# Altium project MCU009B.PrjPcb (part 3 of 4)

## Sheet MCU009B_ADC.SchDoc: ADC
size 431 x 279 mm; Date: Not shown in title block; ApprovedBy: Not shown in title block; CheckedBy: Not shown in title block; Author: Not shown in title block; CompanyName: Not shown in title block; Engineer: Not shown in title block; Organization: Not shown in title block; Address1: Not shown in title block; Address2: Not shown in title block; Address3: Not shown in title block; Address4: Not shown in title block; DocumentNumber: 4; Revision: Use project parameter SCH_Rev; SheetNumber: 4; SheetTotal: 7; PageSetup: Record=PageOptions|CenterHorizontal=True|CenterVertical=True|PrintScale=1.00|XCorrection=1.00|YCorrection=1.00|PrintKind=0|BorderSize=5000000|LeftOffset=0|BottomOffset=0|Orientation=2|PaperLength=1000|PaperWidth=1000|Scale=100|PaperSource=15|PrintQuality=600|MediaType=1|DitherType=10|PaperKind=Letter|PrintScaleMode=1; CurrentTime: Not shown in title block; CurrentDate: Not shown in title block; Time: Not shown in title block; DocumentFullPathAndName: Not shown in title block; DocumentName: Not shown in title block; ModifiedDate: Not shown in title block; ImagePath: Not shown in title block
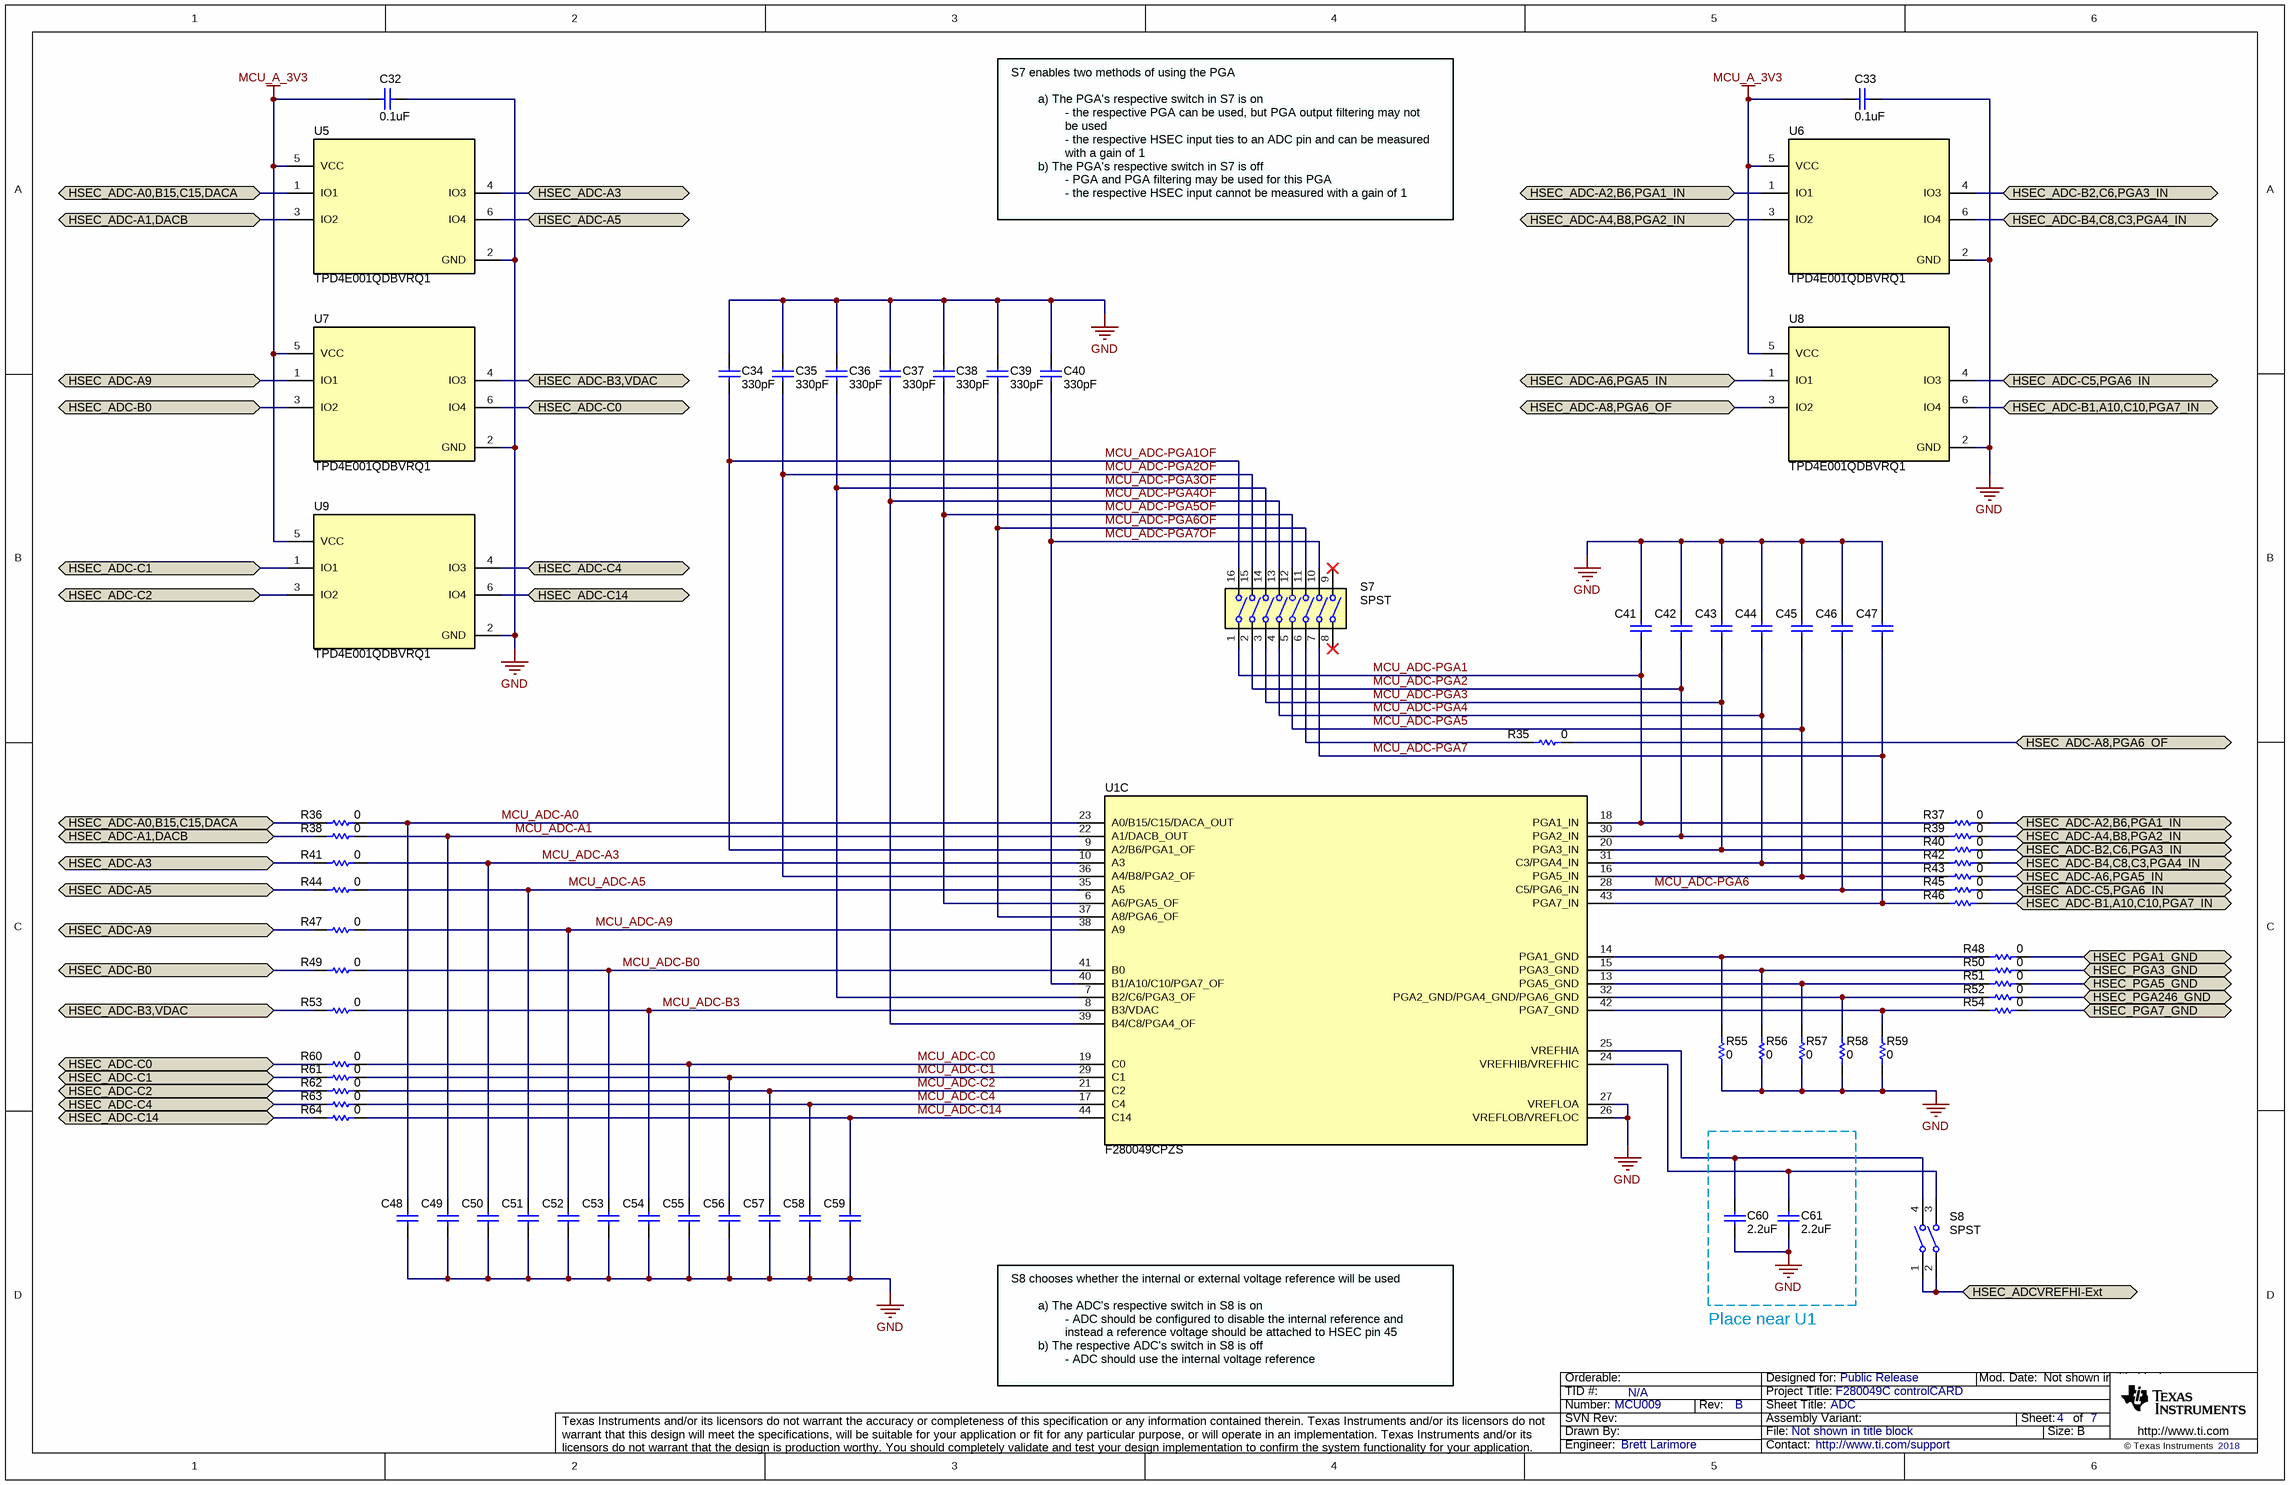
[diagram p3: MCU009B_ADC.SchDoc]

### Parts
(Parts that share a designator on the sheet are numbered #1, #2 ... from top to bottom, then left to right.)
C32  ValueDisplayed: 0.1uF  [0402]  (hidden comment: GRM155R71A104KA01D)
C33  ValueDisplayed: 0.1uF  [0402]  (hidden comment: GRM155R71A104KA01D)
C34  ValueDisplayed: 330pF  [0603]  (hidden comment: GRM1885C1H331JA01D)
C35  ValueDisplayed: 330pF  [0603]  (hidden comment: GRM1885C1H331JA01D)
C36  ValueDisplayed: 330pF  [0603]  (hidden comment: GRM1885C1H331JA01D)
C37  ValueDisplayed: 330pF  [0603]  (hidden comment: GRM1885C1H331JA01D)
C38  ValueDisplayed: 330pF  [0603]  (hidden comment: GRM1885C1H331JA01D)
C39  ValueDisplayed: 330pF  [0603]  (hidden comment: GRM1885C1H331JA01D)
C40  ValueDisplayed: 330pF  [0603]  (hidden comment: GRM1885C1H331JA01D)
C41  GRM188R71C104KA01D  [0603]  (value not drawn)
C42  GRM188R71C104KA01D  [0603]  (value not drawn)
C43  GRM188R71C104KA01D  [0603]  (value not drawn)
C44  GRM188R71C104KA01D  [0603]  (value not drawn)
C45  GRM188R71C104KA01D  [0603]  (value not drawn)
C46  GRM188R71C104KA01D  [0603]  (value not drawn)
C47  GRM188R71C104KA01D  [0603]  (value not drawn)
C48  GRM188R71C104KA01D  [0603]  (value not drawn)
C49  GRM188R71C104KA01D  [0603]  (value not drawn)
C50  GRM188R71C104KA01D  [0603]  (value not drawn)
C51  GRM188R71C104KA01D  [0603]  (value not drawn)
C52  GRM188R71C104KA01D  [0603]  (value not drawn)
C53  GRM188R71C104KA01D  [0603]  (value not drawn)
C54  GRM188R71C104KA01D  [0603]  (value not drawn)
C55  GRM188R71C104KA01D  [0603]  (value not drawn)
C56  GRM188R71C104KA01D  [0603]  (value not drawn)
C57  GRM188R71C104KA01D  [0603]  (value not drawn)
C58  GRM188R71C104KA01D  [0603]  (value not drawn)
C59  GRM188R71C104KA01D  [0603]  (value not drawn)
C60  ValueDisplayed: 2.2uF  [0603]  (hidden comment: GRM188R61A225KE34D)
C61  ValueDisplayed: 2.2uF  [0603]  (hidden comment: GRM188R61A225KE34D)
R35  ValueDisplayed: 0  [0603]  (hidden comment: CRCW06030000Z0EA)
R36  ValueDisplayed: 0  [0603]  (hidden comment: CRCW06030000Z0EA)
R37  ValueDisplayed: 0  [0603]  (hidden comment: CRCW06030000Z0EA)
R38  ValueDisplayed: 0  [0603]  (hidden comment: CRCW06030000Z0EA)
R39  ValueDisplayed: 0  [0603]  (hidden comment: CRCW06030000Z0EA)
R40  ValueDisplayed: 0  [0603]  (hidden comment: CRCW06030000Z0EA)
R41  ValueDisplayed: 0  [0603]  (hidden comment: CRCW06030000Z0EA)
R42  ValueDisplayed: 0  [0603]  (hidden comment: CRCW06030000Z0EA)
R43  ValueDisplayed: 0  [0603]  (hidden comment: CRCW06030000Z0EA)
R44  ValueDisplayed: 0  [0603]  (hidden comment: CRCW06030000Z0EA)
R45  ValueDisplayed: 0  [0603]  (hidden comment: CRCW06030000Z0EA)
R46  ValueDisplayed: 0  [0603]  (hidden comment: CRCW06030000Z0EA)
R47  ValueDisplayed: 0  [0603]  (hidden comment: CRCW06030000Z0EA)
R48  ValueDisplayed: 0  [0603]  (hidden comment: CRCW06030000Z0EA)
R49  ValueDisplayed: 0  [0603]  (hidden comment: CRCW06030000Z0EA)
R50  ValueDisplayed: 0  [0603]  (hidden comment: CRCW06030000Z0EA)
R51  ValueDisplayed: 0  [0603]  (hidden comment: CRCW06030000Z0EA)
R52  ValueDisplayed: 0  [0603]  (hidden comment: CRCW06030000Z0EA)
R53  ValueDisplayed: 0  [0603]  (hidden comment: CRCW06030000Z0EA)
R54  ValueDisplayed: 0  [0603]  (hidden comment: CRCW06030000Z0EA)
R55  ValueDisplayed: 0  [0603]  (hidden comment: CRCW06030000Z0EA)
R56  ValueDisplayed: 0  [0603]  (hidden comment: CRCW06030000Z0EA)
R57  ValueDisplayed: 0  [0603]  (hidden comment: CRCW06030000Z0EA)
R58  ValueDisplayed: 0  [0603]  (hidden comment: CRCW06030000Z0EA)
R59  ValueDisplayed: 0  [0603]  (hidden comment: CRCW06030000Z0EA)
R60  ValueDisplayed: 0  [0603]  (hidden comment: CRCW06030000Z0EA)
R61  ValueDisplayed: 0  [0603]  (hidden comment: CRCW06030000Z0EA)
R62  ValueDisplayed: 0  [0603]  (hidden comment: CRCW06030000Z0EA)
R63  ValueDisplayed: 0  [0603]  (hidden comment: CRCW06030000Z0EA)
R64  ValueDisplayed: 0  [0603]  (hidden comment: CRCW06030000Z0EA)
S7  Circuit: SPST  [SW_218-8LP]  (hidden comment: 218-8LPST)
S8  Circuit: SPST  [SW_218-2LP]  (hidden comment: 218-2LPST)
U1#2  F280049CPZS  [PZ0100A_N]  (part C of 5)
U5  TPD4E001QDBVRQ1  [DBV0006A_N]
U6  TPD4E001QDBVRQ1  [DBV0006A_N]
U7  TPD4E001QDBVRQ1  [DBV0006A_N]
U8  TPD4E001QDBVRQ1  [DBV0006A_N]
U9  TPD4E001QDBVRQ1  [DBV0006A_N]

### Ports
HSEC_ADC-A0,B15,C15,DACA (bidir), HSEC_ADC-A1,DACB (bidir), HSEC_ADC-A2,B6,PGA1_IN (bidir), HSEC_ADC-A3 (bidir), HSEC_ADC-A4,B8,PGA2_IN (bidir), HSEC_ADC-A5 (bidir), HSEC_ADC-A6,PGA5_IN (bidir), HSEC_ADC-A8,PGA6_OF (bidir), HSEC_ADC-A9 (bidir), HSEC_ADC-B0 (bidir), HSEC_ADC-B1,A10,C10,PGA7_IN (bidir), HSEC_ADC-B2,C6,PGA3_IN (bidir), HSEC_ADC-B3,VDAC (bidir), HSEC_ADC-B4,C8,C3,PGA4_IN (bidir), HSEC_ADC-C0 (bidir), HSEC_ADC-C1 (bidir), HSEC_ADC-C2 (bidir), HSEC_ADC-C4 (bidir), HSEC_ADC-C5,PGA6_IN (bidir), HSEC_ADC-C14 (bidir), HSEC_ADCVREFHI-Ext (bidir), HSEC_PGA1_GND (bidir), HSEC_PGA3_GND (bidir), HSEC_PGA5_GND (bidir), HSEC_PGA7_GND (bidir), HSEC_PGA246_GND (bidir)

### Nets
GND: C32.2 C33.2 C34.1 C35.1 C36.1 C37.1 C38.1 C39.1 C40.1 C41.1 C42.1 C43.1 C44.1 C45.1 C46.1 C47.1 C48.2 C49.2 C50.2 C51.2 C52.2 C53.2 C54.2 C55.2 C56.2 C57.2 C58.2 C59.2 C60.1 C61.1 R55.1 R56.1 R57.1 R58.1 R59.1 U1#2.26(VREFLOB/VREFLOC) U1#2.27(VREFLOA) U5.2(GND) U6.2(GND) U7.2(GND) U8.2(GND) U9.2(GND)
MCU_A_3V3: C32.1 C33.1 U5.5(VCC) U6.5(VCC) U7.5(VCC) U8.5(VCC) U9.5(VCC)
HSEC_ADC-A0,B15,C15,DACA: R36.2 U5.1(IO1) ; port HSEC_ADC-A0,B15,C15,DACA
HSEC_ADC-A1,DACB: R38.2 U5.3(IO2) ; port HSEC_ADC-A1,DACB
HSEC_ADC-A2,B6,PGA1_IN: R37.1 U6.1(IO1) ; port HSEC_ADC-A2,B6,PGA1_IN
HSEC_ADC-A3: R41.2 U5.4(IO3) ; port HSEC_ADC-A3
HSEC_ADC-A4,B8,PGA2_IN: R39.1 U6.3(IO2) ; port HSEC_ADC-A4,B8,PGA2_IN
HSEC_ADC-A5: R44.2 U5.6(IO4) ; port HSEC_ADC-A5
HSEC_ADC-A6,PGA5_IN: R43.1 U8.1(IO1) ; port HSEC_ADC-A6,PGA5_IN
HSEC_ADC-A8,PGA6_OF: R35.1 U8.3(IO2) ; port HSEC_ADC-A8,PGA6_OF
HSEC_ADC-A9: R47.2 U7.1(IO1) ; port HSEC_ADC-A9
HSEC_ADC-B0: R49.2 U7.3(IO2) ; port HSEC_ADC-B0
HSEC_ADC-B1,A10,C10,PGA7_IN: R46.1 U8.6(IO4) ; port HSEC_ADC-B1,A10,C10,PGA7_IN
HSEC_ADC-B2,C6,PGA3_IN: R40.1 U6.4(IO3) ; port HSEC_ADC-B2,C6,PGA3_IN
HSEC_ADC-B3,VDAC: R53.2 U7.4(IO3) ; port HSEC_ADC-B3,VDAC
HSEC_ADC-B4,C8,C3,PGA4_IN: R42.1 U6.6(IO4) ; port HSEC_ADC-B4,C8,C3,PGA4_IN
HSEC_ADC-C0: R60.2 U7.6(IO4) ; port HSEC_ADC-C0
HSEC_ADC-C1: R61.2 U9.1(IO1) ; port HSEC_ADC-C1
HSEC_ADC-C2: R62.2 U9.3(IO2) ; port HSEC_ADC-C2
HSEC_ADC-C4: R63.2 U9.4(IO3) ; port HSEC_ADC-C4
HSEC_ADC-C5,PGA6_IN: R45.1 U8.4(IO3) ; port HSEC_ADC-C5,PGA6_IN
HSEC_ADC-C14: R64.2 U9.6(IO4) ; port HSEC_ADC-C14
HSEC_ADCVREFHI-Ext: S8.1 S8.2 ; port HSEC_ADCVREFHI-Ext
HSEC_PGA1_GND: R48.1 ; port HSEC_PGA1_GND
HSEC_PGA3_GND: R50.1 ; port HSEC_PGA3_GND
HSEC_PGA5_GND: R51.1 ; port HSEC_PGA5_GND
HSEC_PGA7_GND: R54.1 ; port HSEC_PGA7_GND
HSEC_PGA246_GND: R52.1 ; port HSEC_PGA246_GND
MCU_ADC-A0: C48.1 R36.1 U1#2.23(A0/B15/C15/DACA_OUT)
MCU_ADC-A1: C49.1 R38.1 U1#2.22(A1/DACB_OUT)
MCU_ADC-A3: C50.1 R41.1 U1#2.10(A3)
MCU_ADC-A5: C51.1 R44.1 U1#2.35(A5)
MCU_ADC-A9: C52.1 R47.1 U1#2.38(A9)
MCU_ADC-B0: C53.1 R49.1 U1#2.41(B0)
MCU_ADC-B3: C54.1 R53.1 U1#2.8(B3/VDAC)
MCU_ADC-C0: C55.1 R60.1 U1#2.19(C0)
MCU_ADC-C1: C56.1 R61.1 U1#2.29(C1)
MCU_ADC-C2: C57.1 R62.1 U1#2.21(C2)
MCU_ADC-C4: C58.1 R63.1 U1#2.17(C4)
MCU_ADC-C14: C59.1 R64.1 U1#2.44(C14)
MCU_ADC-PGA1: C41.2 R37.2 S7.1 U1#2.18(PGA1_IN)
MCU_ADC-PGA1OF: C34.2 S7.16(1A) U1#2.9(A2/B6/PGA1_OF)
MCU_ADC-PGA2: C42.2 R39.2 S7.2 U1#2.30(PGA2_IN)
MCU_ADC-PGA2OF: C35.2 S7.15(2A) U1#2.36(A4/B8/PGA2_OF)
MCU_ADC-PGA3: C43.2 R40.2 S7.3 U1#2.20(PGA3_IN)
MCU_ADC-PGA3OF: C36.2 S7.14(3A) U1#2.7(B2/C6/PGA3_OF)
MCU_ADC-PGA4: C44.2 R42.2 S7.4 U1#2.31(C3/PGA4_IN)
MCU_ADC-PGA4OF: C37.2 S7.13(4A) U1#2.39(B4/C8/PGA4_OF)
MCU_ADC-PGA5: C45.2 R43.2 S7.5 U1#2.16(PGA5_IN)
MCU_ADC-PGA5OF: C38.2 S7.12(5A) U1#2.6(A6/PGA5_OF)
MCU_ADC-PGA6: C46.2 R45.2 U1#2.28(C5/PGA6_IN)
MCU_ADC-PGA6OF: C39.2 S7.11(6A) U1#2.37(A8/PGA6_OF)
MCU_ADC-PGA7: C47.2 R46.2 S7.7 U1#2.43(PGA7_IN)
MCU_ADC-PGA7OF: C40.2 S7.10(7A) U1#2.40(B1/A10/C10/PGA7_OF)
NetC60_2: C60.2 S8.4 U1#2.25(VREFHIA)
NetC61_2: C61.2 S8.3 U1#2.24(VREFHIB/VREFHIC)
NetR35_2: R35.2 S7.6
NetR48_2: R48.2 R55.2 U1#2.14(PGA1_GND)
NetR50_2: R50.2 R56.2 U1#2.15(PGA3_GND)
NetR51_2: R51.2 R57.2 U1#2.13(PGA5_GND)
NetR52_2: R52.2 R58.2 U1#2.32(PGA2_GND/PGA4_GND/PGA6_GND)
NetR54_2: R54.2 R59.2 U1#2.42(PGA7_GND)

Not connected (* = marked no-connect by the designer): S7 8* 9(8A)*

### Notes on the sheet
- S7 enables two methods of using the PGA
- a) The PGA's respective switch in S7 is on
- b) The PGA's respective switch in S7 is off
- - the respective HSEC input ties to an ADC pin and can be measured
- - the respective PGA can be used, but PGA output filtering may not
- with a gain of 1
- be used
- - PGA and PGA filtering may be used for this PGA
- - the respective HSEC input cannot be measured with a gain of 1
- S8 chooses whether the internal or external voltage reference will be used
- a) The ADC's respective switch in S8 is on
- b) The respective ADC's switch in S8 is off
- - ADC should be configured to disable the internal reference and
- - ADC should use the internal voltage reference
- instead a reference voltage should be attached to HSEC pin 45
- Place near U1
- Drawn By:
- SVN Rev:
- Number:
- TID #:
- Orderable:
- Rev:
- Sheet Title:
- File:
- Project Title:
- Designed for:
- Assembly Variant:
- Mod. Date:
- Sheet:
- Size:
- of
- B
- http://www.ti.com
- Texas Instruments and/or its licensors do not warrant the accuracy or completeness of this specification or any information contained therein. Texas Instruments and/or its licensors do not warrant that this design will meet the specifications, will be suitable for your application or fit for any particular purpose, or will operate in an implementation. Texas Instruments and/or its licensors do not warrant that the design is production worthy. You should completely validate and test your design implementation to confirm the system functionality for your application.
- Engineer:
- Contact:
- © Texas Instruments

### Library data of the parts
C32 C33 = CMP-0006629-2: as C9 on sheet MCU009B_Power+Misc; CompType: Capacitor; PartNumber: GRM155R71A104KA01D; PackageReference: 0402; RoHS: Y; Tolerance_%: 10%; Value2: 10V; MountType: SMT; Technology: Ceramic; TempCo: X7R; Cap_Case: 0402; Published: 2008-06-19; Publisher: Texas Instruments; LatestRevisionDate: 2017-03-09; ComponentLink1Description: Datasheet link; ComponentLink1URL: http://search.murata.co.jp/Ceramy/PnsearchViewAction.do?HnOFG=ON&HnNFG=ON&SEL_CNT=50&sLang=en&sKey=GRM155R71A104KA01D&x=9&y=9&search=startwith; Supplier 1: Digi-Key; Supplier Part Number 1: GRM155R71A104KA01D-ND; Supplier 2: Newark; Supplier Part Number 2: 14T3278; Supplier 3: Mouser; Supplier Part Number 3: 81-GRM155R71A104KA1D; AEC Qualified: ?; SizeY_mm: 0.5
C34-C40 = CMP-0007209-4: CAP, CERM, 330 pF, 50 V, +/- 5%, C0G/NP0, 0603; Manufacturer: MuRata; Polarized: N; Value: 330pF; U/M: EA; Value1: Unknown; VDC_V: 50V; TaMin_C: -55°C; TaMax_C: 125°C; SizeArea_mm2: 1.28; SizeAreaWB_mm2: 4.68; SizeX_mm: 1.6; SizeY_mm: 0.8; SizeZ_mm: 1; AEC Category: Q200; CompType: Capacitor; PartNumber: GRM1885C1H331JA01D; PackageReference: 0603; RoHS: Y; Cap_F: 330pF; Tolerance_%: 5%; Value2: 50V; MountType: SMT; Technology: Ceramic; TempCo: C0G/NP0; Cap_Case: 0603; Published: 2008-06-19; Publisher: Texas Instruments; LatestRevisionDate: 2017-03-09; ComponentLink1Description: Datasheet link; ComponentLink1URL: http://search.murata.co.jp/Ceramy/PnsearchViewAction.do?HnOFG=ON&HnNFG=ON&SEL_CNT=50&sLang=en&sKey=GRM1885C1H331JA01D&x=9&y=9&search=startwith; Supplier 1: Digi-Key; Supplier Part Number 1: 490-1439-1-ND; Supplier 2: Mouser; Supplier Part Number 2: 81-GRM39C331J50; Supplier 3: Farnell; Supplier Part Number 3: 8819890; AEC Qualified: ?
C41-C54 C56-C59 = CMP-0007378-5: CAP, CERM, 0.1 uF, 16 V, +/- 10%, X7R, 0603; Manufacturer: MuRata; Polarized: N; Value: 0.1uF; U/M: EA; Cap_F: 100nF; Value1: Unknown; VDC_V: 16V; TaMin_C: -55°C; TaMax_C: 125°C; SizeArea_mm2: 1.28; SizeAreaWB_mm2: 4.68; SizeX_mm: 1.6; SizeY_mm: 0.8; SizeZ_mm: 1; AEC Category: Q200; CompType: Capacitor; PartNumber: GRM188R71C104KA01D; ValueDisplayed: 0.1uF; PackageReference: 0603; RoHS: Y; Tolerance_%: 10%; Value2: 16V; MountType: SMT; Technology: Ceramic; TempCo: X7R; Cap_Case: 0603; Published: 2008-06-19; Publisher: Texas Instruments; LatestRevisionDate: 2017-03-09; ComponentLink1Description: Datasheet link; ComponentLink1URL: http://search.murata.co.jp/Ceramy/PnsearchViewAction.do?HnOFG=ON&HnNFG=ON&SEL_CNT=50&sLang=en&sKey=GRM188R71C104KA01D&x=9&y=9&search=startwith; Supplier 1: Digi-Key; Supplier Part Number 1: 490-1532-1-ND; Supplier 2: Mouser; Supplier Part Number 2: 81-GRM39X104K16; Supplier 3: Farnell; Supplier Part Number 3: 1828890; AEC Qualified: ?
C55 = CMP-0007378-5: CAP, CERM, 0.1 uF, 16 V, +/- 10%, X7R, 0603; Manufacturer: MuRata; Polarized: N; CompType: Capacitor; Value: 0.1uF; U/M: EA; Cap_F: 100nF; Value1: Unknown; VDC_V: 16V; TaMin_C: -55°C; TaMax_C: 125°C; SizeArea_mm2: 1.28; SizeAreaWB_mm2: 4.68; SizeX_mm: 1.6; SizeY_mm: 0.8; SizeZ_mm: 1; AEC Category: Q200; PartNumber: GRM188R71C104KA01D; ValueDisplayed: 0.1uF; PackageReference: 0603; RoHS: Y; Tolerance_%: 10%; Value2: 16V; MountType: SMT; Technology: Ceramic; TempCo: X7R; Cap_Case: 0603; Published: 2008-06-19; Publisher: Texas Instruments; LatestRevisionDate: 2017-03-09; ComponentLink1Description: Datasheet link; ComponentLink1URL: http://search.murata.co.jp/Ceramy/PnsearchViewAction.do?HnOFG=ON&HnNFG=ON&SEL_CNT=50&sLang=en&sKey=GRM188R71C104KA01D&x=9&y=9&search=startwith; Supplier 1: Digi-Key; Supplier Part Number 1: 490-1532-1-ND; Supplier 2: Mouser; Supplier Part Number 2: 81-GRM39X104K16; Supplier 3: Farnell; Supplier Part Number 3: 1828890; AEC Qualified: ?
C60 C61 = CMP-0007323-5: CAP, CERM, 2.2 uF, 10 V, +/- 10%, X5R, 0603; Manufacturer: MuRata; Polarized: N; Value: 2.2uF; U/M: EA; Cap_F: 2.2µF; Value1: Unknown; VDC_V: 10V; TaMin_C: -55°C; TaMax_C: 85°C; AEC Category: Q200; SizeArea_mm2: 1.28; SizeAreaWB_mm2: 4.68; SizeX_mm: 1.6; SizeY_mm: 0.8; SizeZ_mm: 1; CompType: Capacitor; PartNumber: GRM188R61A225KE34D; PackageReference: 0603; RoHS: Y; Tolerance_%: 10%; Value2: 10V; MountType: SMT; Technology: Ceramic; TempCo: X5R; Cap_Case: 0603; Published: 2008-06-19; Publisher: Texas Instruments; LatestRevisionDate: 2017-03-09; ComponentLink1Description: Datasheet link; ComponentLink1URL: http://search.murata.co.jp/Ceramy/PnsearchViewAction.do?HnOFG=ON&HnNFG=ON&SEL_CNT=50&sLang=en&sKey=GRM188R61A225KE34D&x=9&y=9&search=startwith; Supplier 1: Digi-Key; Supplier Part Number 1: 490-1545-1-ND; Supplier 2: Mouser; Supplier Part Number 2: 81-GRM188R61A225KE34; Supplier 3: Farnell; Supplier Part Number 3: 1828799; AEC Qualified: ?
R35-R64 = CMP-0025697-4: RES, 0, 5%, 0.1 W, AEC-Q200 Grade 0, 0603; Manufacturer: Vishay-Dale; Value: 0; Value_Code: 0000; Power_W: 100mW; Value2: 0.1W; VDC_V: 75V; TempCo: 200 ppm/C; EIA_Code: E24; AEC Category: Q200; AEC Qualified: Y; SizeArea_mm2: 1.28; SizeX_mm: 1.6; SizeY_mm: 0.8; SizeZ_mm: 1; CompType: Resistor; PartNumber: CRCW06030000Z0EA; PackageReference: 0603; RoHS: E; Res_ohm: 0; Tolerance_%: 5%; Value1: 5%; MountType: SMT; Technology: Thick Film; ComponentLink1Description: Datasheet link; ComponentLink1URL: http://www.vishay.com/docs/20035/dcrcwe3.pdf; Supplier 1: Digi-Key; Supplier Part Number 1: 541-0.0GCT-ND; Supplier 2: Newark; Supplier Part Number 2: 52K8014; Supplier 3: Mouser; Supplier Part Number 3: 71-CRCW0603-0-E3; AEC Grade: 0
S7 = CMP-0002229-1: Switch, SPST, 8 Pos, 25mA, 24VDC, SMD; Manufacturer: CTS Electrocomponents; VDC_V: 24V; SwitchFunction: Off-On; PositionCount: 8; CurrentRating_mA: 25A; PartNumber: 218-8LPST; MountType: SMT; ComponentLink1Description: Datasheet Link; ComponentLink1URL: http://www.ctscorp.com/components/Datasheets/218.pdf; RoHS: Y; Orientation: Top Actuated; CompType: Switch; PackageReference: 11.33x5.8mm; Publisher: Texas Instruments; LatestRevisionDate: 2017-03-09; Supplier 1: Digi-Key; Supplier Part Number 1: CT2188LPST-ND; Supplier 2: Mouser; Supplier Part Number 2: 774-2188LPST
S8 = CMP-0002230-1: Switch, SPST, 2 Pos, 25mA, 24VDC, SMD; Manufacturer: CTS Electrocomponents; VDC_V: 24V; SwitchFunction: Off-On; PositionCount: 2; CurrentRating_mA: 25A; PartNumber: 218-2LPST; MountType: SMT; ComponentLink1Description: Datasheet Link; ComponentLink1URL: http://www.ctscorp.com/components/Datasheets/218.pdf; RoHS: Y; Orientation: Top Actuated; CompType: Switch; PackageReference: 3.71x5.8mm; Publisher: Texas Instruments; LatestRevisionDate: 2017-03-09; Supplier 1: Digi-Key; Supplier Part Number 1: CT2182LPST-ND; Supplier 2: Mouser; Supplier Part Number 2: 774-2182LPST
U1#2 = CMP-0078352-1: Piccolo Microcontroller, PZ0100A (LQFP-100); Manufacturer: Texas Instruments; SizeArea_mm2: 256; SizeAreaWB_mm2: 324; SizeX_mm: 16; SizeZ_mm: 1.6; CompType: IC; AEC Category: Q200; AEC Qualified: N; PartNumber: F280049CPZS; PackageReference: PZ0100A; PackageDescription: LQFP-100; MountType: SMT; SizeY_mm: 16; ComponentLink1Description: Datasheet Link; ComponentLink1URL: http://www.ti.com/lit/ds/symlink/tms320f280049c.pdf; Alternate Manufacturer: Texas Instruments; ComponentLink2URL: http://www.ti.com/product/tms320f280049c; ComponentLink2Description: Product Folder
U5-U9 = CMP-0066599-1: Automotive Low-Capacitance 4-Channel +/-15-kV ESD Protection Array for High-Speed Data Interfaces, DBV0006A (SOT-23-6); Manufacturer: Texas Instruments; CompType: IC; U/M: EA; SizeArea_mm2: 8.12; SizeAreaWB_mm2: 14.82; SizeX_mm: 2.8; SizeY_mm: 2.9; SizeZ_mm: 1.45; PartNumber: TPD4E001QDBVRQ1; PackageReference: DBV0006A; MountType: SMT; ComponentLink1Description: Datasheet Link; ComponentLink1URL: http://www.ti.com/lit/ds/symlink/tpd4e001-q1.pdf; RoHS: Y; Publisher: Texas Instruments; LatestRevisionDate: 2017-06-09; Alternate Manufacturer: Texas Instruments; PackageDescription: SOT-23-6; Footprint Path 6: C:\AltiumLibraries\Footprints\TI\.PcbLib

## Sheet MCU009B_Xds100v2Emu.SchDoc: Xds100v2Emu
size 431 x 279 mm; Date: Not shown in title block; ApprovedBy: Not shown in title block; CheckedBy: Not shown in title block; Author: Not shown in title block; CompanyName: Not shown in title block; Engineer: Not shown in title block; Organization: Not shown in title block; Address1: Not shown in title block; Address2: Not shown in title block; Address3: Not shown in title block; Address4: Not shown in title block; DocumentNumber: 5; Revision: Use project parameter SCH_Rev; SheetNumber: 5; SheetTotal: 7; PageSetup: Record=PageOptions|CenterHorizontal=True|CenterVertical=True|PrintScale=1.00|XCorrection=1.00|YCorrection=1.00|PrintKind=0|BorderSize=5000000|LeftOffset=0|BottomOffset=0|Orientation=2|PaperLength=1000|PaperWidth=1000|Scale=100|PaperSource=15|PrintQuality=600|MediaType=1|DitherType=10|PaperKind=Letter|PrintScaleMode=1; CurrentTime: Not shown in title block; CurrentDate: Not shown in title block; Time: Not shown in title block; DocumentFullPathAndName: Not shown in title block; DocumentName: Not shown in title block; ModifiedDate: Not shown in title block; ImagePath: Not shown in title block
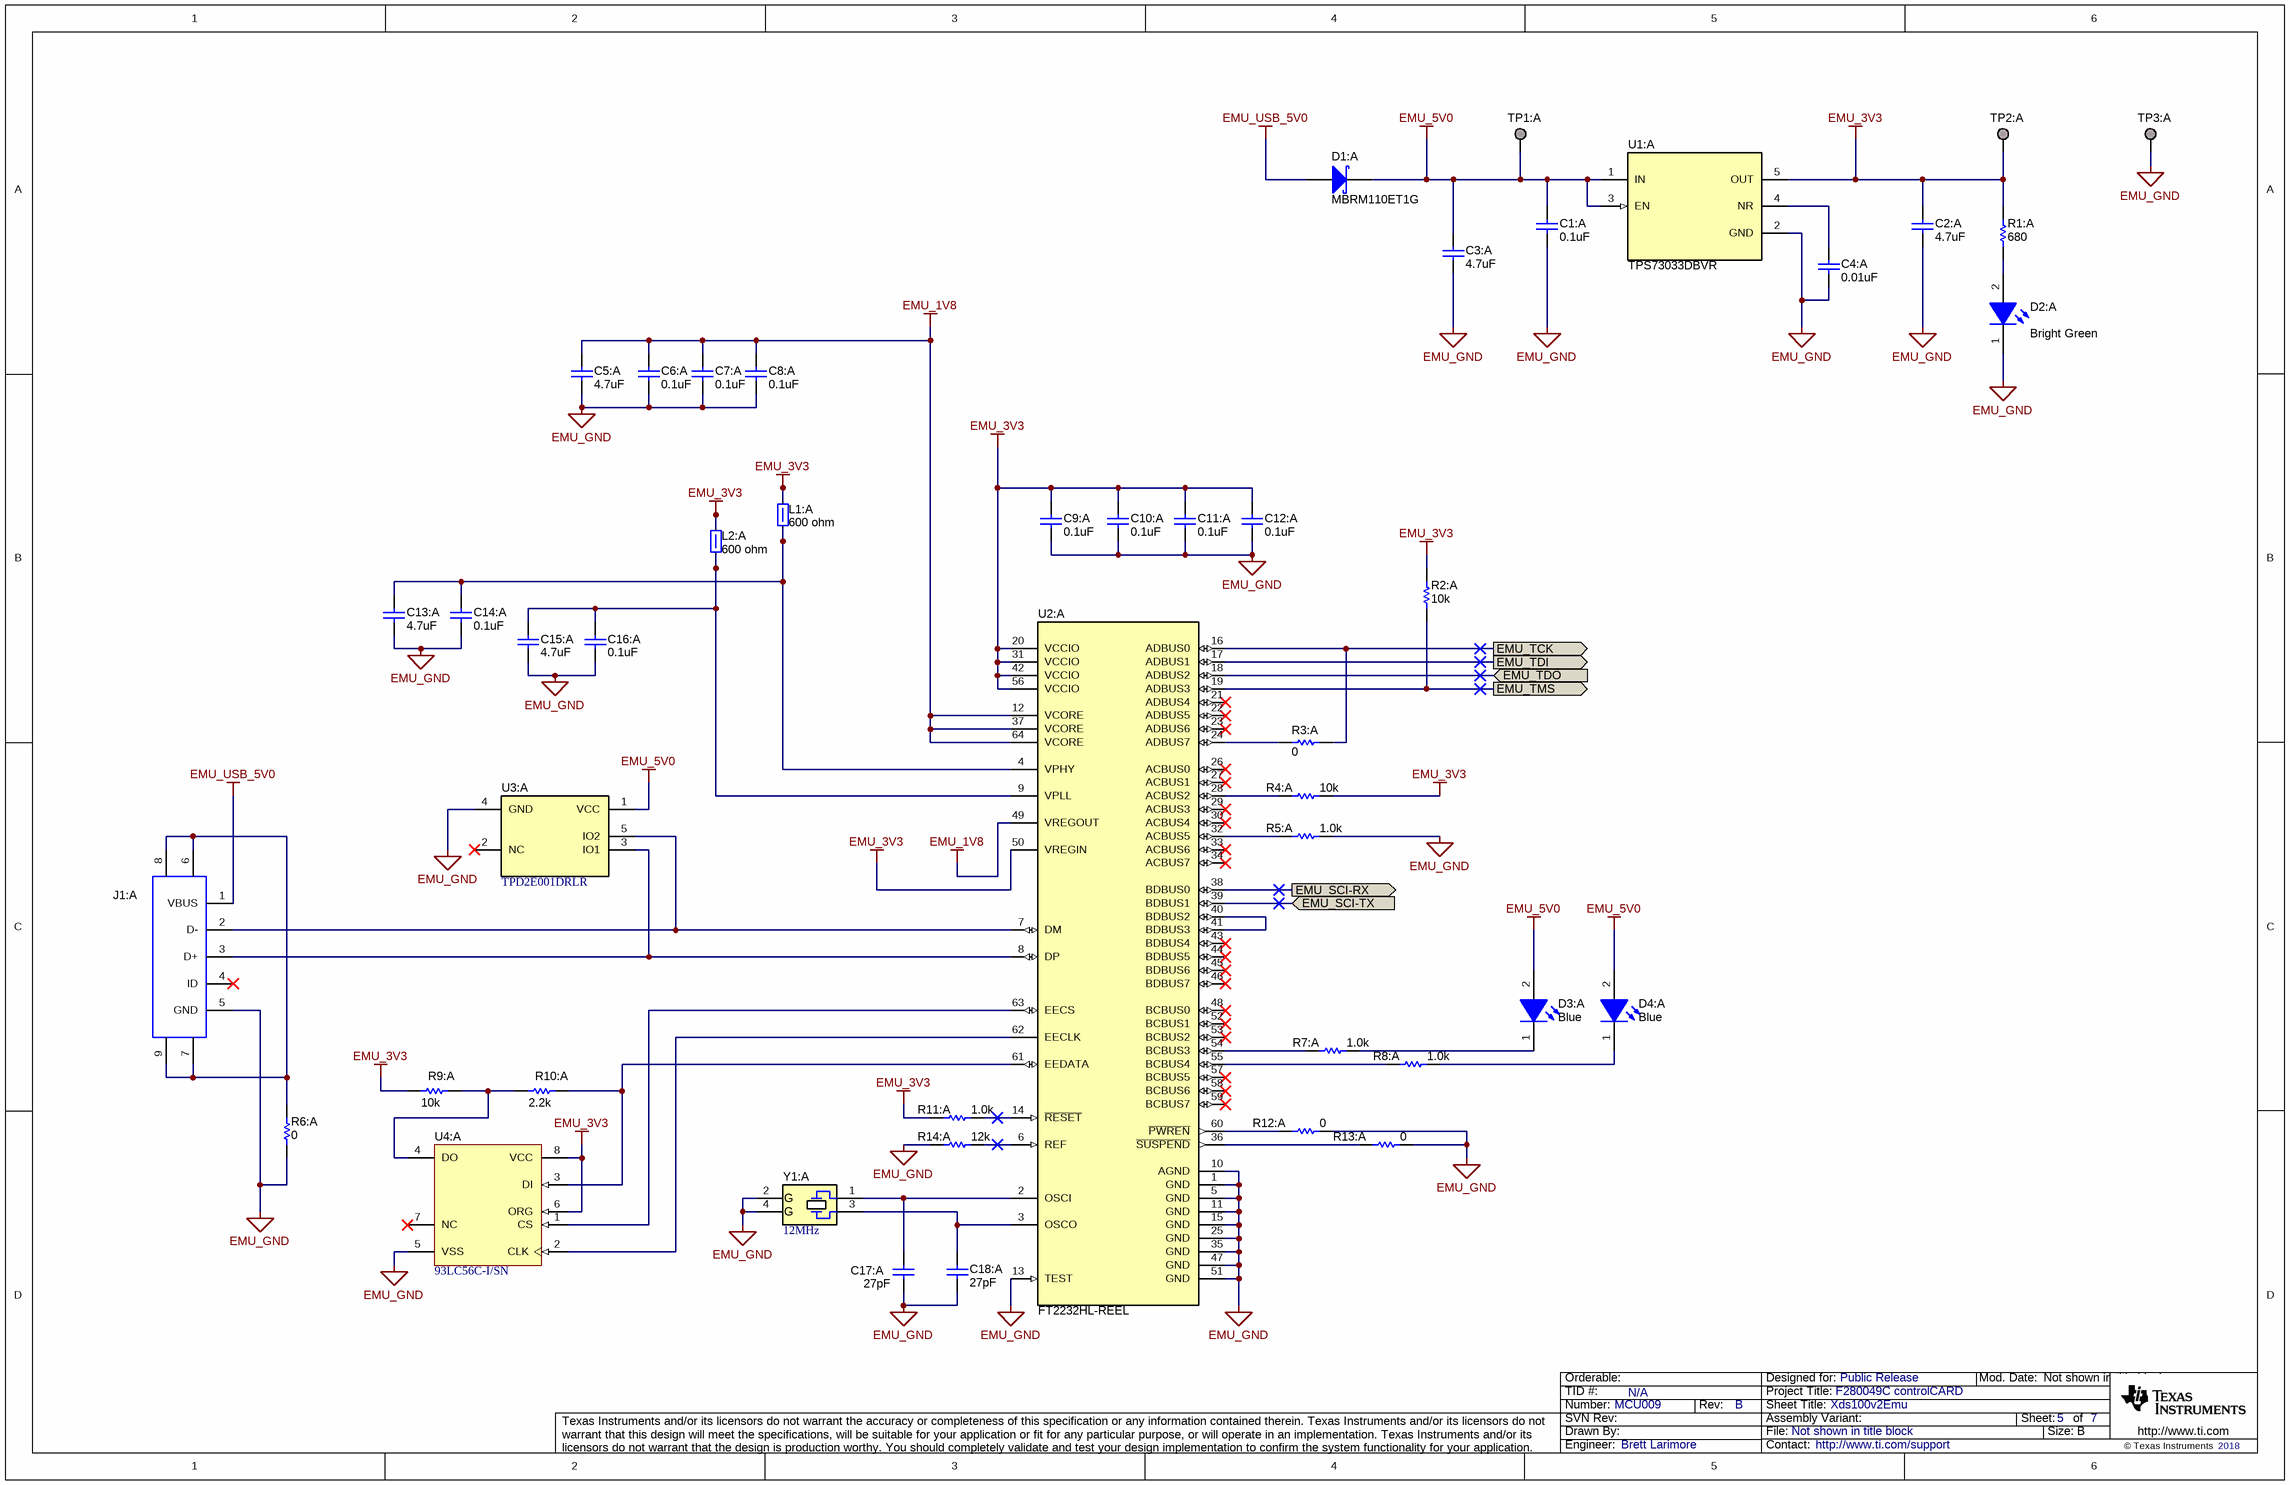
[diagram p4: MCU009B_Xds100v2Emu.SchDoc]

### Parts
C1:A  ValueDisplayed: 0.1uF  [0402]  (hidden comment: GRM155R71A104KA01D)
C2:A  ValueDisplayed: 4.7uF  [0603]  (hidden comment: GRM188R60J475ME19D)
C3:A  ValueDisplayed: 4.7uF  [0603]  (hidden comment: GRM188R60J475ME19D)
C4:A  ValueDisplayed: 0.01uF  [0402]  (hidden comment: GRM155R71C103KA01D)
C5:A  ValueDisplayed: 4.7uF  [0603]  (hidden comment: GRM188R60J475ME19D)
C6:A  ValueDisplayed: 0.1uF  [0402]  (hidden comment: GRM155R71A104KA01D)
C7:A  ValueDisplayed: 0.1uF  [0402]  (hidden comment: GRM155R71A104KA01D)
C8:A  ValueDisplayed: 0.1uF  [0402]  (hidden comment: GRM155R71A104KA01D)
C9:A  ValueDisplayed: 0.1uF  [0402]  (hidden comment: GRM155R71A104KA01D)
C10:A  ValueDisplayed: 0.1uF  [0402]  (hidden comment: GRM155R71A104KA01D)
C11:A  ValueDisplayed: 0.1uF  [0402]  (hidden comment: GRM155R71A104KA01D)
C12:A  ValueDisplayed: 0.1uF  [0402]  (hidden comment: GRM155R71A104KA01D)
C13:A  ValueDisplayed: 4.7uF  [0603]  (hidden comment: GRM188R60J475ME19D)
C14:A  ValueDisplayed: 0.1uF  [0402]  (hidden comment: GRM155R71A104KA01D)
C15:A  ValueDisplayed: 4.7uF  [0603]  (hidden comment: GRM188R60J475ME19D)
C16:A  ValueDisplayed: 0.1uF  [0402]  (hidden comment: GRM155R71A104KA01D)
C17:A  ValueDisplayed: 27pF  [0402]  (hidden comment: GRM1555C1H270JA01D)
C18:A  ValueDisplayed: 27pF  [0402]  (hidden comment: GRM1555C1H270JA01D)
D1:A  MBRM110ET1G  [POWERMITE]
D2:A  value Bright Green  [WL-SMCW_Green_0805]  (hidden comment: 150080VS75000)
D3:A  value Blue  [WL-SMCW_Blue_0805]  (hidden comment: 150080BS75000)
D4:A  value Blue  [WL-SMCW_Blue_0805]  (hidden comment: 150080BS75000)
J1:A  65100516121  [Wurth_65100516121]  (value not drawn)
L1:A  value 600 ohm  [0805_HV]  (hidden comment: HZ0805E601R-10)
L2:A  value 600 ohm  [0805_HV]  (hidden comment: HZ0805E601R-10)
R1:A  ValueDisplayed: 680  [0402]  (hidden comment: CRCW0402680RJNED)
R2:A  ValueDisplayed: 10k  [0402]  (hidden comment: CRCW040210K0JNED)
R3:A  ValueDisplayed: 0  [0402]  (hidden comment: CRCW04020000Z0ED)
R4:A  ValueDisplayed: 10k  [0402]  (hidden comment: CRCW040210K0JNED)
R5:A  ValueDisplayed: 1.0k  [0402]  (hidden comment: CRCW04021K00JNED)
R6:A  ValueDisplayed: 0  [0402]  (hidden comment: CRCW04020000Z0ED)
R7:A  ValueDisplayed: 1.0k  [0402]  (hidden comment: CRCW04021K00JNED)
R8:A  ValueDisplayed: 1.0k  [0402]  (hidden comment: CRCW04021K00JNED)
R9:A  ValueDisplayed: 10k  [0402]  (hidden comment: CRCW040210K0JNED)
R10:A  ValueDisplayed: 2.2k  [0402]  (hidden comment: CRCW04022K20JNED)
R11:A  ValueDisplayed: 1.0k  [0402]  (hidden comment: CRCW04021K00JNED)
R12:A  ValueDisplayed: 0  [0402]  (hidden comment: CRCW04020000Z0ED)
R13:A  ValueDisplayed: 0  [0402]  (hidden comment: CRCW04020000Z0ED)
R14:A  ValueDisplayed: 12k  [0402]  (hidden comment: CRCW040212K0JNED)
TP1:A  TESTPOINT  [TP_50MIL-25MILHOLE]  (value not drawn)  (no BOM)
TP2:A  TESTPOINT  [TP_50MIL-25MILHOLE]  (value not drawn)  (no BOM)
TP3:A  TESTPOINT  [TP_50MIL-25MILHOLE]  (value not drawn)  (no BOM)
U1:A  TPS73033DBVR  [DBV0005A_N]
U2:A  FT2232HL-REEL  [LQFP64_N]
U3:A  TPD2E001DRLR  [DRL0005A]
U4:A  93LC56C-I/SN  [SOIC-8]
Y1:A  12MHz  [ECS_ECX-53B]

### Ports
EMU_SCI-RX (out), EMU_SCI-TX (in), EMU_TCK (out), EMU_TDI (out), EMU_TDO (in), EMU_TMS (out)

### Nets
EMU_1V8: C5:A.2 C6:A.2 C7:A.2 C8:A.2 U2:A.12(VCORE) U2:A.37(VCORE) U2:A.49(VREGOUT) U2:A.64(VCORE)
EMU_3V3: C2:A.1 C9:A.2 C10:A.2 C11:A.2 C12:A.2 L1:A.2 L2:A.2 R1:A.1 R2:A.2 R4:A.2 R9:A.1 R11:A.1 TP2:A.1 U1:A.5(OUT) U2:A.20(VCCIO) U2:A.31(VCCIO) U2:A.42(VCCIO) U2:A.50(VREGIN) U2:A.56(VCCIO) U4:A.6(ORG) U4:A.8(VCC)
EMU_5V0: C1:A.2 C3:A.1 D1:A.1(K) D3:A.2(A) D4:A.2(A) TP1:A.1 U1:A.1(IN) U1:A.3(EN) U3:A.1(VCC)
EMU_GND: C1:A.1 C2:A.2 C3:A.2 C4:A.1 C5:A.1 C6:A.1 C7:A.1 C8:A.1 C9:A.1 C10:A.1 C11:A.1 C12:A.1 C13:A.2 C14:A.1 C15:A.2 C16:A.1 C17:A.1 C18:A.1 D2:A.1(K) J1:A.5(GND) R5:A.2 R6:A.2 R12:A.1 R13:A.1 R14:A.1 TP3:A.1 U1:A.2(GND) U2:A.1(GND) U2:A.5(GND) U2:A.10(AGND) U2:A.11(GND) U2:A.13(TEST) U2:A.15(GND) U2:A.25(GND) U2:A.35(GND) U2:A.47(GND) U2:A.51(GND) U3:A.4(GND) U4:A.5(VSS) Y1:A.2(GND) Y1:A.4(GND)
EMU_USB_5V0: D1:A.2(A) J1:A.1(VBUS)
EMU_SCI-RX: U2:A.38(BDBUS0) ; port EMU_SCI-RX
EMU_SCI-TX: U2:A.39(BDBUS1) ; port EMU_SCI-TX
EMU_TCK: R3:A.1 U2:A.16(ADBUS0) ; port EMU_TCK
EMU_TDI: U2:A.17(ADBUS1) ; port EMU_TDI
EMU_TDO: U2:A.18(ADBUS2) ; port EMU_TDO
EMU_TMS: R2:A.1 U2:A.19(ADBUS3) ; port EMU_TMS
NetC4:A_2: C4:A.2 U1:A.4(NR)
NetC13:A_1: C13:A.1 C14:A.2 L1:A.1 U2:A.4(VPHY)
NetC15:A_1: C15:A.1 C16:A.2 L2:A.1 U2:A.9(VPLL)
NetC17:A_2: C17:A.2 U2:A.2(OSCI) Y1:A.1
NetC18:A_2: C18:A.2 U2:A.3(OSCO) Y1:A.3
NetD2:A_2: D2:A.2(A) R1:A.2
NetD3:A_1: D3:A.1(K) R7:A.2
NetD4:A_1: D4:A.1(K) R8:A.2
NetJ1:A_2: J1:A.2(D-) U2:A.7(DM) U3:A.5(IO2)
NetJ1:A_3: J1:A.3(D+) U2:A.8(DP) U3:A.3(IO1)
NetJ1:A_6: J1:A.6 J1:A.7 J1:A.8 J1:A.9 R6:A.1
NetR3:A_2: R3:A.2 U2:A.24(ADBUS7)
NetR4:A_1: R4:A.1 U2:A.28(ACBUS2)
NetR5:A_1: R5:A.1 U2:A.32(ACBUS5)
NetR7:A_1: R7:A.1 U2:A.54(BCBUS3)
NetR8:A_1: R8:A.1 U2:A.55(BCBUS4)
NetR9:A_2: R9:A.2 R10:A.1 U4:A.4(DO)
NetR10:A_2: R10:A.2 U2:A.61(EEDATA) U4:A.3(DI)
NetR11:A_2: R11:A.2 U2:A.14(~{RESET})
NetR12:A_2: R12:A.2 U2:A.60(~{PWREN})
NetR13:A_2: R13:A.2 U2:A.36(~{SUSPEND})
NetR14:A_2: R14:A.2 U2:A.6(REF)
NetU2:A_40: U2:A.40(BDBUS2) U2:A.41(BDBUS3)
NetU2:A_62: U2:A.62(EECLK) U4:A.2(CLK)
NetU2:A_63: U2:A.63(EECS) U4:A.1(CS)

Not connected (* = marked no-connect by the designer): J1:A 4(ID)*; U2:A 21(ADBUS4)* 22(ADBUS5)* 23(ADBUS6)* 26(ACBUS0)* 27(ACBUS1)* 29(ACBUS3)* 30(ACBUS4)* 33(ACBUS6)* 34(ACBUS7)* 43(BDBUS4)* 44(BDBUS5)* 45(BDBUS6)* 46(BDBUS7)* 48(BCBUS0)* 52(BCBUS1)* 53(BCBUS2)* 57(BCBUS5)* 58(BCBUS6)* 59(BCBUS7)*; U3:A 2(NC)*; U4:A 7(NC)*

### Notes on the sheet
- Drawn By:
- SVN Rev:
- Number:
- TID #:
- Orderable:
- Rev:
- Sheet Title:
- File:
- Project Title:
- Designed for:
- Assembly Variant:
- Mod. Date:
- Sheet:
- Size:
- of
- B
- http://www.ti.com
- Texas Instruments and/or its licensors do not warrant the accuracy or completeness of this specification or any information contained therein. Texas Instruments and/or its licensors do not warrant that this design will meet the specifications, will be suitable for your application or fit for any particular purpose, or will operate in an implementation. Texas Instruments and/or its licensors do not warrant that the design is production worthy. You should completely validate and test your design implementation to confirm the system functionality for your application.
- Engineer:
- Contact:
- © Texas Instruments
- (in symbol CMP-0004646-3) G

### Library data of the parts
C1:A C6:A C7:A C8:A C9:A C10:A C11:A C12:A C14:A C16:A = CMP-0006629-2: CAP, CERM, 0.1 uF, 10 V, +/- 10%, X7R, 0402; Manufacturer: MuRata; Polarized: N; Value: 0.1uF; U/M: EA; Cap_F: 100nF; Value1: Unknown; VDC_V: 10V; TaMin_C: -55°C; TaMax_C: 125°C; AEC Category: Q200; SizeArea_mm2: 0.5; SizeAreaWB_mm2: 3; SizeX_mm: 1; SizeZ_mm: 0.6; CompType: Capacitor; PartNumber: GRM155R71A104KA01D; PackageReference: 0402; RoHS: Y; Tolerance_%: 10%; Value2: 10V; MountType: SMT; Technology: Ceramic; TempCo: X7R; Cap_Case: 0402; Published: 2008-06-19; Publisher: Texas Instruments; LatestRevisionDate: 2017-03-09; ComponentLink1Description: Datasheet link; ComponentLink1URL: http://search.murata.co.jp/Ceramy/PnsearchViewAction.do?HnOFG=ON&HnNFG=ON&SEL_CNT=50&sLang=en&sKey=GRM155R71A104KA01D&x=9&y=9&search=startwith; Supplier 1: Digi-Key; Supplier Part Number 1: GRM155R71A104KA01D-ND; Supplier 2: Newark; Supplier Part Number 2: 14T3278; Supplier 3: Mouser; Supplier Part Number 3: 81-GRM155R71A104KA1D; AEC Qualified: ?; SizeY_mm: 0.5
C2:A C3:A C5:A C13:A C15:A = CMP-0007312-5: CAP, CERM, 4.7 uF, 6.3 V, +/- 20%, X5R, 0603; Manufacturer: MuRata; Polarized: N; Value: 4.7uF; U/M: EA; Cap_F: 4.7µF; ESR_ohm: 1m; Value1: 0.001 ohm; VDC_V: 6.3V; TaMin_C: -55°C; TaMax_C: 85°C; AEC Category: Q200; SizeArea_mm2: 1.28; SizeAreaWB_mm2: 4.68; SizeX_mm: 1.6; SizeY_mm: 0.8; SizeZ_mm: 1; CompType: Capacitor; PartNumber: GRM188R60J475ME19D; PackageReference: 0603; RoHS: Y; Tolerance_%: 20%; Value2: 6.3V; MountType: SMT; Technology: Ceramic; TempCo: X5R; Cap_Case: 0603; Published: 2008-06-19; Publisher: Texas Instruments; LatestRevisionDate: 2017-03-09; ComponentLink1Description: Datasheet link; ComponentLink1URL: http://search.murata.co.jp/Ceramy/image/img/PDF/ENG/GRM188R60J475ME19.pdf; Supplier 1: Digi-Key; Supplier Part Number 1: 490-5421-1-ND; Supplier 2: Mouser; Supplier Part Number 2: 81-GRM188R60J475ME9D; AEC Qualified: ?
C4:A = CMP-0006639-2: CAP, CERM, 0.01 uF, 16 V, +/- 10%, X7R, 0402; Manufacturer: MuRata; Polarized: N; Value: 0.01uF; U/M: EA; Cap_F: 10nF; Value1: Unknown; VDC_V: 16V; TaMin_C: -55°C; TaMax_C: 125°C; AEC Category: Q200; SizeArea_mm2: 0.5; SizeAreaWB_mm2: 3; SizeX_mm: 1; SizeZ_mm: 0.6; CompType: Capacitor; PartNumber: GRM155R71C103KA01D; PackageReference: 0402; RoHS: Y; Tolerance_%: 10%; Value2: 16V; MountType: SMT; Technology: Ceramic; TempCo: X7R; Cap_Case: 0402; Published: 2008-06-19; Publisher: Texas Instruments; LatestRevisionDate: 2017-03-09; ComponentLink1Description: Datasheet link; ComponentLink1URL: http://search.murata.co.jp/Ceramy/PnsearchViewAction.do?HnOFG=ON&HnNFG=ON&SEL_CNT=50&sLang=en&sKey=GRM155R71C103KA01D&x=9&y=9&search=startwith; Supplier 1: Digi-Key; Supplier Part Number 1: 490-1313-1-ND; Supplier 2: Newark; Supplier Part Number 2: 14T3279; Supplier 3: Mouser; Supplier Part Number 3: 81-GRM36X103K16; AEC Qualified: ?; SizeY_mm: 0.5
C17:A C18:A = CMP-0006443-2: CAP, CERM, 27 pF, 50 V, +/- 5%, C0G/NP0, 0402; Manufacturer: MuRata; Polarized: N; Value: 27pF; U/M: EA; Value1: Unknown; VDC_V: 50V; TaMin_C: -55°C; TaMax_C: 125°C; AEC Category: Q200; SizeArea_mm2: 0.5; SizeAreaWB_mm2: 3; SizeX_mm: 1; SizeZ_mm: 0.6; CompType: Capacitor; PartNumber: GRM1555C1H270JA01D; PackageReference: 0402; RoHS: Y; Cap_F: 27pF; Tolerance_%: 5%; Value2: 50V; MountType: SMT; Technology: Ceramic; TempCo: C0G/NP0; Cap_Case: 0402; Published: 2008-06-19; Publisher: Texas Instruments; LatestRevisionDate: 2017-03-09; ComponentLink1Description: Datasheet link; ComponentLink1URL: http://search.murata.co.jp/Ceramy/PnsearchViewAction.do?HnOFG=ON&HnNFG=ON&SEL_CNT=50&sLang=en&sKey=GRM1555C1H270JA01D&x=9&y=9&search=startwith; Supplier 1: Newark; Supplier Part Number 1: 14T3294; Supplier 2: Mouser; Supplier Part Number 2: 81-GRM1555C1H270JA1D; Supplier 3: Farnell; Supplier Part Number 3: 1828877; AEC Qualified: ?; SizeY_mm: 0.5
D1:A = CMP-0028747-1: Diode, Schottky, 10 V, 1 A, AEC-Q101, POWERMITE; Manufacturer: ON Semiconductor; U/M: EA; Vf_V: 5.3dV; Value: 10V; Value1: 1A; Value2: 0.53V; TJmax_C: 150°C; AEC Category: Q101; AEC Qualified: Y; SizeAreaWB_mm2: 14.945; SizeArea_mm2: 7.995; SizeX_mm: 3.9; SizeY_mm: 2.05; SizeZ_mm: 1.15; Green_Lifecycle: Not Set; Green_REACh: Incomplete; CompType: Diode; PartNumber: MBRM110ET1G; PackageReference: POWERMITE; Io_A: 1A; Vr_V: 10V; MountType: SMT; Type: Schottky; RoHS: Y; Published: 2008-06-26; Publisher: Texas Instruments; LatestRevisionDate: 2017-05-08; ComponentLink1Description: Datasheet link; ComponentLink1URL: http://www.onsemi.com/pub_link/Collateral/MBRM110E-D.PDF; Supplier 1: Digi-Key; Supplier Part Number 1: MBRM110ET1GOSCT-ND; Supplier 2: Newark; Supplier Part Number 2: 45J0787; Supplier 3: Mouser; Supplier Part Number 3: 863-MBRM110ET1G; Green_EU RoHS-2: Incomplete; Green_EU RoHS: Incomplete
D2:A = CMP-0002960-2: LED, Bright Green, SMD; Manufacturer: Wurth Elektronik; Type: AlInGaP; Vf_V: 2V; Io_A: 20mA; Vr_V: 5V; Tjmax_C: 85°C; Power_TotalModule: 72mW; Value1: 0.072W; Angle: 140; U/M: EA; PartNumber: 150080VS75000; PackageReference: LED_0805; RoHS: Y; CompType: LED; MountType: SMT; Value2: 2V; Color: Bright Green; Published: 2008-07-11; Publisher: Texas Instruments; ComponentLink1URL: http://katalog.we-online.de/led/datasheet/150080VS75000.pdf; ComponentLink1Description: Datasheet link; LatestRevisionDate: 2017-03-09; Supplier 1: Digi-Key; Supplier Part Number 1: 732-4986-1-ND; Supplier 2: Newark; Supplier Part Number 2: 95W3803; Supplier 3: Mouser; Supplier Part Number 3: 710-150080VS75000
D3:A D4:A = CMP-0002959-2: LED, Blue, SMD; Manufacturer: Wurth Elektronik; Type: InGaN; Vf_V: 3.2V; Io_A: 20mA; Vr_V: 5V; Tjmax_C: 85°C; Power_TotalModule: 105mW; Value1: 0.105W; Angle: 140; U/M: EA; CompType: LED; PartNumber: 150080BS75000; MountType: SMT; RoHS: Y; PackageReference: LED_0805; Value2: 3.2V; Color: Blue; Published: 2008-07-11; Publisher: Texas Instruments; ComponentLink1URL: http://katalog.we-online.de/led/datasheet/150080BS75000.pdf; ComponentLink1Description: Datasheet link; LatestRevisionDate: 2017-03-09; Supplier 1: Digi-Key; Supplier Part Number 1: 732-4982-1-ND; Supplier 2: Newark; Supplier Part Number 2: 95W3799; Supplier 3: Mouser; Supplier Part Number 3: 710-150080BS75000
J1:A = CMP-0054809-1: Connector, Receptacle, USB Mini B 2.0, SMT; Manufacturer: Wurth Elektronik; Pitch_mm: 0.8; Gender: Female; Row_Count: 1; ContactFinish: Gold; Current_A: 1A; Voltage_V: 30V; Cert_UL: Y; CNHeader: FALSE; CT: TRUE; Green_Lifecycle: Active; Green_REACh: Passed; PartNumber: 65100516121; PackageReference: Connector, Receptacle, USB Mini B 2.0, 5 Position, SMT; CompType: USB; RoHS: Y; MountType: SMT; ComponentLink1Description: Datasheet URL; ComponentLink1URL: http://katalog.we-online.de/em/datasheet/65100516121.pdf; Publisher: Texas Instruments; LatestRevisionDate: 26/05/2017; Supplier 1: Digi-Key; Supplier Part Number 1: 732-2109-1-ND; Supplier 2: Newark; Supplier Part Number 2: 19P1304; Supplier 3: Mouser; Supplier Part Number 3: 710-65100516121; Orientation: R/A; PinCount: 5; Color: Black; Cert_CULUS: Y; Green_EU RoHS-2: Incomplete; Green_EU RoHS: Passed
L1:A L2:A = CMP-0003398-1: Ferrite Bead, 600 ohm @ 100 MHz, 0.5 A, 0805; Manufacturer: Laird-Signal Integrity Products; Imax_A: 5dA; DCR_ohm: 3d; Value1: 0.3 ohm; Value2: 0.5A; ZTyp@100MHz_Ohm: 600; SizeArea_mm2: 2.5; SizeAreaWB_mm2: 6.75; SizeX_mm: 2; SizeY_mm: 1.25; SizeZ_mm: 1.45; CompType: Ferrite Bead; PartNumber: HZ0805E601R-10; MountType: SMT; PackageReference: 0805; Published: 2014-04-30; Publisher: Texas Instruments; LatestRevisionDate: 2017-03-09; ComponentLink1Description: Datasheet link; ComponentLink1URL: http://www.lairdtech.com/WorkArea/linkit.aspx?linkIdentifier=id&ItemID=4884; RoHS: Y; Supplier 1: Digi-Key; Supplier Part Number 1: 240-2399-1-ND; Supplier 2: Newark; Supplier Part Number 2: 66W8909; Supplier 3: Mouser; Supplier Part Number 3: 875-HZ0805E601R-10; ValueDisplayed: 600 ohm
R1:A = CMP-0026962-3: RES, 680, 5%, 0.063 W, AEC-Q200 Grade 0, 0402; Manufacturer: Vishay-Dale; Value: 680; Value_Code: 680R; Power_W: 63mW; Value2: 0.063W; VDC_V: 50V; TempCo: 200 ppm/C; EIA_Code: E24; AEC Category: Q200; AEC Qualified: Y; AEC Grade: 0; SizeArea_mm2: 0.5; SizeX_mm: 1; SizeZ_mm: 0.6; CompType: Resistor; PartNumber: CRCW0402680RJNED; PackageReference: 0402; RoHS: E; Res_ohm: 680; Tolerance_%: 5%; Value1: 5%; MountType: SMT; Technology: Thick Film; ComponentLink1Description: Datasheet link; ComponentLink1URL: http://www.vishay.com/docs/20035/dcrcwe3.pdf; Supplier 1: Digi-Key; Supplier Part Number 1: 541-680JCT-ND; Supplier 2: Newark; Supplier Part Number 2: 59M6744; Supplier 3: Mouser; Supplier Part Number 3: 71-CRCW0402J-680-E3; SizeY_mm: 0.5
R2:A R4:A R9:A = CMP-0026825-5: RES, 10 k, 5%, 0.063 W, AEC-Q200 Grade 0, 0402; Manufacturer: Vishay-Dale; Value: 10k; Value_Code: 10k0; Power_W: 63mW; Value2: 0.063W; VDC_V: 50V; TempCo: 200 ppm/C; EIA_Code: E24; AEC Category: Q200; AEC Qualified: Y; AEC Grade: 0; SizeArea_mm2: 0.5; SizeX_mm: 1; SizeZ_mm: 0.6; CompType: Resistor; PartNumber: CRCW040210K0JNED; PackageReference: 0402; RoHS: E; Res_ohm: 10k; Tolerance_%: 5%; Value1: 5%; MountType: SMT; Technology: Thick Film; ComponentLink1Description: Datasheet link; ComponentLink1URL: http://www.vishay.com/docs/20035/dcrcwe3.pdf; Supplier 1: Digi-Key; Supplier Part Number 1: 541-10KJCT-ND; Supplier 2: Newark; Supplier Part Number 2: 59M6696; Supplier 3: Mouser; Supplier Part Number 3: 71-CRCW0402J-10K-E3; SizeY_mm: 0.5
R3:A R6:A R12:A R13:A = CMP-0026822-3: RES, 0, 5%, 0.063 W, AEC-Q200 Grade 0, 0402; Manufacturer: Vishay-Dale; Value: 0; Value_Code: 0000; Power_W: 63mW; Value2: 0.063W; VDC_V: 50V; TempCo: 200 ppm/C; EIA_Code: E24; AEC Category: Q200; AEC Qualified: Y; SizeArea_mm2: 0.5; SizeX_mm: 1; SizeZ_mm: 0.6; CompType: Resistor; PartNumber: CRCW04020000Z0ED; PackageReference: 0402; RoHS: E; Res_ohm: 0; Tolerance_%: 5%; Value1: 5%; MountType: SMT; Technology: Thick Film; ComponentLink1Description: Datasheet link; ComponentLink1URL: http://www.vishay.com/docs/20035/dcrcwe3.pdf; Supplier 1: Digi-Key; Supplier Part Number 1: 541-0.0JCT-ND; Supplier 2: Newark; Supplier Part Number 2: 52K6543; Supplier 3: Mouser; Supplier Part Number 3: 71-CRCW0402-0-E3; AEC Grade: 0; SizeY_mm: 0.5
R5:A R7:A R8:A R11:A = CMP-0026852-3: RES, 1.0 k, 5%, 0.063 W, AEC-Q200 Grade 0, 0402; Manufacturer: Vishay-Dale; Value: 1.0k; Res_ohm: 1k; Value_Code: 1k00; Power_W: 63mW; Value2: 0.063W; VDC_V: 50V; TempCo: 200 ppm/C; EIA_Code: E24; AEC Category: Q200; AEC Qualified: Y; AEC Grade: 0; SizeArea_mm2: 0.5; SizeX_mm: 1; SizeZ_mm: 0.6; CompType: Resistor; PartNumber: CRCW04021K00JNED; PackageReference: 0402; RoHS: E; Tolerance_%: 5%; Value1: 5%; MountType: SMT; Technology: Thick Film; ComponentLink1Description: Datasheet link; ComponentLink1URL: http://www.vishay.com/docs/20035/dcrcwe3.pdf; Supplier 1: Digi-Key; Supplier Part Number 1: 541-1.0KJCT-ND; Supplier 2: Newark; Supplier Part Number 2: 59M6691; Supplier 3: Mouser; Supplier Part Number 3: 71-CRCW0402J-1.0K-E3; SizeY_mm: 0.5
R10:A = CMP-0026890-5: RES, 2.2 k, 5%, 0.063 W, AEC-Q200 Grade 0, 0402; Manufacturer: Vishay-Dale; Value: 2.2k; Value_Code: 2k20; Power_W: 63mW; Value2: 0.063W; VDC_V: 50V; TempCo: 200 ppm/C; EIA_Code: E24; AEC Category: Q200; AEC Qualified: Y; AEC Grade: 0; SizeArea_mm2: 0.5; SizeX_mm: 1; SizeZ_mm: 0.6; CompType: Resistor; PartNumber: CRCW04022K20JNED; PackageReference: 0402; RoHS: E; Res_ohm: 2.2k; Tolerance_%: 5%; Value1: 5%; MountType: SMT; Technology: Thick Film; ComponentLink1Description: Datasheet link; ComponentLink1URL: http://www.vishay.com/docs/20035/dcrcwe3.pdf; Supplier 1: Digi-Key; Supplier Part Number 1: 541-2.2KJCT-ND; Supplier 2: Newark; Supplier Part Number 2: 59M6710; Supplier 3: Mouser; Supplier Part Number 3: 71-CRCW0402J-2.2K-E3; SizeY_mm: 0.5
R14:A = CMP-0026834-3: RES, 12 k, 5%, 0.063 W, AEC-Q200 Grade 0, 0402; Manufacturer: Vishay-Dale; Value: 12k; Value_Code: 12k0; Power_W: 63mW; Value2: 0.063W; VDC_V: 50V; TempCo: 200 ppm/C; EIA_Code: E24; AEC Category: Q200; AEC Qualified: Y; AEC Grade: 0; SizeArea_mm2: 0.5; SizeX_mm: 1; SizeZ_mm: 0.6; CompType: Resistor; PartNumber: CRCW040212K0JNED; PackageReference: 0402; RoHS: E; Res_ohm: 12k; Tolerance_%: 5%; Value1: 5%; MountType: SMT; Technology: Thick Film; ComponentLink1Description: Datasheet link; ComponentLink1URL: http://www.vishay.com/docs/20035/dcrcwe3.pdf; Supplier 1: Digi-Key; Supplier Part Number 1: 541-12KJCT-ND; Supplier 2: Newark; Supplier Part Number 2: 89M6603; Supplier 3: Mouser; Supplier Part Number 3: 71-CRCW040212K0JNED; SizeY_mm: 0.5
TP1:A TP2:A TP3:A = CMP-0078143-2: TEST POINT.  No entry in BOM.; CompType: Testpoint; PackageReference: N/A; Manufacturer: N/A; PartNumber: N/A; Library Reference: TESTPOINT
U1:A = CMP-0073823-1: Low-Noise, High PSRR, RF 200-mA Low-Dropout Linear Regulators, DBV0005A (SOT-23-5); Alternate PartNumber: TPS73033DBVT; Manufacturer: Texas Instruments; CompType: IC; U/M: EA; SizeArea_mm2: 8.12; SizeAreaWB_mm2: 14.82; SizeX_mm: 2.8; SizeY_mm: 2.9; SizeZ_mm: 1.45; Green_Lifecycle: Active; Green_REACh: Passed; PartNumber: TPS73033DBVR; PackageReference: DBV0005A; MountType: SMT; ComponentLink1Description: Datasheet Link; ComponentLink1URL: http://www.ti.com/lit/ds/symlink/tps730.pdf; RoHS: Y; Publisher: Texas Instruments; LatestRevisionDate: 2017-06-09; Alternate Manufacturer: Texas Instruments; PackageDescription: SOT-23-5; Footprint Path 6: C:\AltiumLibraries\Footprints\TI\.PcbLib; Green_EU RoHS-2: Passed; Green_EU RoHS: Passed
U2:A = CMP-0004796-1: Dual High Speed USB To Multipurpose UART/FIFO IC, LQFP-64; Manufacturer: FTDI; PartNumber: FT2232HL-REEL; MountType: SMT; ComponentLink1Description: Datasheet URL; ComponentLink1URL: http://www.ftdichip.com/Support/Documents/DataSheets/ICs/DS_FT2232H.pdf; RoHS: Y; PackageReference: LQFP_10x10mm; Publisher: Texas Instruments; LatestRevisionDate: 09/03/2017; Supplier 1: Digi-Key; Supplier Part Number 1: 768-1024-1-ND; Supplier 2: Mouser; Supplier Part Number 2: 895-FT2232HL
U3:A = CMP-0043096-2: Low-Capacitance + / - 15 kV ESD-Protection Array for High-Speed Data Interfaces, 2 Channels, -40 to +85 degC, 5-pin SOT (DRL), Green (RoHS & no Sb/Br); Manufacturer: Texas Instruments; Breakdown Voltage(Min)(V): 11; IEC 61000-4-2 Air-Gap(+/- kV): 15; IEC 61000-4-2 Contact(+/- kV): 8; IO Capacitance(Typ)(pF): 1.5; IO Leakage Current(nA): 1; SubFamily: ESD Solution; USB High Speed: TRUE; DatasheetVersion: SLLS684F; PackageVersion: revD, Aug-2007; PackageReference: DRL0005A; PackageDescription: 5-Pin Plastic Small Outline, Flat Lead 0.5 mm Pitch; Eco-Plan: Green (RoHS & no Sb/Br); PartNumber: TPD2E001DRLR; ComponentLink1Description: Manufacturer URL; ComponentLink1URL: http://www.ti.com/; ComponentLink2Description: Datasheet; ComponentLink2URL: http://www.ti.com/general/docs/lit/getliterature.tsp?genericPartNumber=TPD2E001&fileType=pdf; ComponentLink3Description: URL Link1; ComponentLink3URL: SamplesURL:http://www.ti.com/product/tpd2e001#samples; Mounting Technology: Surface Mount
U4:A = CMP-0005261-2: 2K Microwire Compatible Serial EEPROM, SOIC-8; Manufacturer: Microchip; SizeAreaWB_mm2: 55.131; SizeArea_mm2: 29.351; SizeX_mm: 5.99; SizeY_mm: 4.9; SizeZ_mm: 1.75; PartNumber: 93LC56C-I/SN; MountType: SMT; ComponentLink1Description: Datasheet URL; ComponentLink1URL: http://ww1.microchip.com/downloads/en/DeviceDoc/21794G.pdf; RoHS: Y; PackageReference: SOIC-8; Publisher: Texas Instruments; LatestRevisionDate: 09/03/2017; Supplier 1: Digi-Key; Supplier Part Number 1: 93LC56C-I/SN-ND; Supplier 2: Newark; Supplier Part Number 2: 30H4775; Supplier 3: Mouser; Supplier Part Number 3: 579-93LC56C-I/SNG
Y1:A = CMP-0004646-3: Crystal, 12 MHz, 20pF, SMD; PartNumber: ECS-120-20-30B-TR; Manufacturer: ECS Inc.; TaMin_C: -20°C; TaMax_C: 70°C; Frequency Stability: +/-50ppm; CompType: Crystal; PackageReference: 5x3.2mm; MountType: SMT; RoHS: Y; ComponentLink1Description: Datasheet Link; ComponentLink1URL: http://www.ecsxtal.com/store/pdf/ecx_53b.pdf; Supplier 1: Digi-Key; Supplier Part Number 1: XC1118CT-ND; Supplier 2: Mouser; Supplier Part Number 2: 520-ECS-120-20-30B; Frequency_Fixed: 12MHz

## Sheet MCU009B_EVM_Hardware.SchDoc: EVM Hardware
size 431 x 279 mm; Date: Not shown in title block; ApprovedBy: Not shown in title block; CheckedBy: Not shown in title block; Author: Not shown in title block; CompanyName: Not shown in title block; Engineer: Not shown in title block; Organization: Not shown in title block; Address1: Not shown in title block; Address2: Not shown in title block; Address3: Not shown in title block; Address4: Not shown in title block; DocumentNumber: 7; Revision: Use project parameter SCH_Rev; SheetNumber: 7; SheetTotal: 7; PageSetup: Record=PageOptions|CenterHorizontal=True|CenterVertical=True|PrintScale=1.00|XCorrection=1.00|YCorrection=1.00|PrintKind=0|BorderSize=5000000|LeftOffset=0|BottomOffset=0|Orientation=2|PaperLength=1000|PaperWidth=1000|Scale=100|PaperSource=15|PrintQuality=600|MediaType=1|DitherType=10|PaperKind=Letter|PrintScaleMode=1; CurrentTime: Not shown in title block; CurrentDate: Not shown in title block; Time: Not shown in title block; DocumentFullPathAndName: Not shown in title block; DocumentName: Not shown in title block; ModifiedDate: Not shown in title block; ImagePath: Not shown in title block
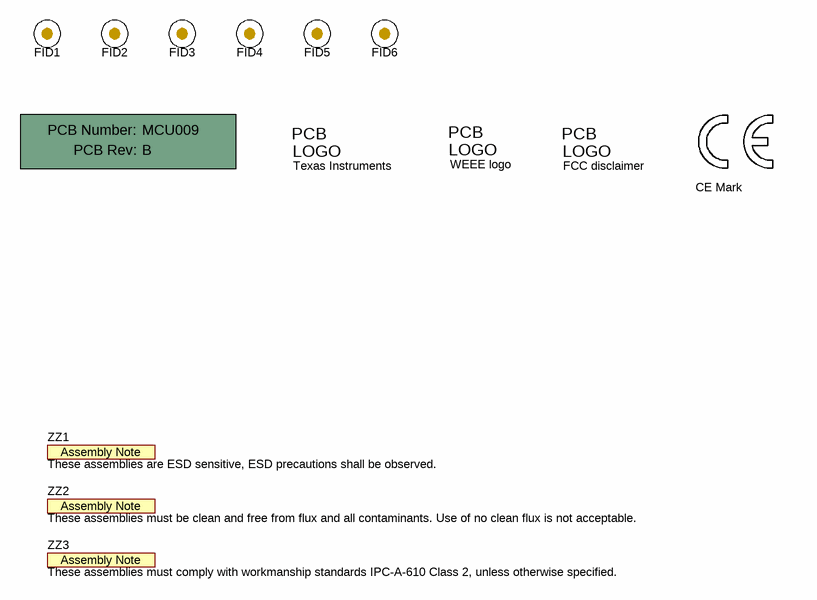
[diagram p5: MCU009B_EVM_Hardware.SchDoc]

### Parts
!PCB1  Printed Circuit Board  (value not drawn)  (mechanical)
FID1  Fiducial  [Fiducial10-20]  (value not drawn)
FID2  Fiducial  [Fiducial10-20]  (value not drawn)
FID3  Fiducial  [Fiducial10-20]  (value not drawn)
FID4  Fiducial  [Fiducial10-20]  (value not drawn)
FID5  Fiducial  [Fiducial10-20]  (value not drawn)
FID6  Fiducial  [Fiducial10-20]  (value not drawn)
Logo1  Texas Instruments  [TI_Symbol_Overlay_Small]  (no BOM)
Logo2  WEEE logo  [WEEE_Minimum]  (no BOM)
Logo3  FCC disclaimer  [FCC_disclaimer]  (no BOM)
LOGO4  CE Mark  [CE_Mark_5mm]  (no BOM)
ZZ1  These assemblies are ESD sensitive, ESD precautions shall be observed.  [AssemblyNote]  (no BOM)
ZZ2  These assemblies must be clean and free from flux and all contaminants. Use of no clean flux is not acceptable.  [AssemblyNote]  (no BOM)
ZZ3  These assemblies must comply with workmanship standards IPC-A-610 Class 2, unless otherwise specified.  [AssemblyNote]  (no BOM)

### Notes on the sheet
- Drawn By:
- SVN Rev:
- Number:
- TID #:
- Orderable:
- Rev:
- Sheet Title:
- File:
- Project Title:
- Designed for:
- Assembly Variant:
- Mod. Date:
- Sheet:
- Size:
- of
- B
- http://www.ti.com
- Texas Instruments and/or its licensors do not warrant the accuracy or completeness of this specification or any information contained therein. Texas Instruments and/or its licensors do not warrant that this design will meet the specifications, will be suitable for your application or fit for any particular purpose, or will operate in an implementation. Texas Instruments and/or its licensors do not warrant that the design is production worthy. You should completely validate and test your design implementation to confirm the system functionality for your application.
- Engineer:
- Contact:
- © Texas Instruments
- (in symbol CMP-0003618-2) PCB Number:; PCB Rev:
- (in symbol CMP-0074769-1) PCB; LOGO
- (in symbol CMP-0074838-1) PCB; LOGO
- (in symbol CMP-0074847-1) PCB; LOGO

### Library data of the parts
!PCB1 = CMP-0003618-2: Manufacturer: Any; PartNumber: MCU009; CompType: PCB; RoHS: O; MountType: N/A; Publisher: Texas Instruments; LatestRevisionDate: 2017-03-09; Key: PCB
FID1-FID6 = CMP-0077181-1: Fiducial mark.  There is nothing to buy or mount.; CompType: Fiducial; Manufacturer: N/A; MountType: N/A; PackageReference: N/A; PartNumber: N/A; ClassName: FiducialMark; Library Reference: Fiducial
Logo1 = CMP-0074838-1: Texas Instrument Corporate Signature; SymbolCreator: a0412235; Lib Reference: TI_Logo; SymbolVersion: 2011-08-22; Published: 2009-03-03; Publisher: Texas Instruments; ClassName: Logo; LatestRevisionDate: 2017-07-06; PartNumber: Texas Instruments; Library Reference: Logo
Logo2 = CMP-0074769-1: Library Reference: WEEE logo; Lib Reference: WEEE logo; PartNumber: WEEE logo
Logo3 = CMP-0074847-1: FCC_disclaimer; Published: 2009-03-03; Publisher: Texas Instruments; LatestRevisionDate: 2017-07-06; Lib Reference: FCC_disclaimer; PartNumber: FCC disclaimer; Library Reference: Logo
LOGO4 = CMP-0074844-1: SymbolCreator: a0412235; Published: 2009-03-03; Publisher: Texas Instruments; LatestRevisionDate: 2017-07-06; Lib Reference: CE Mark; PartNumber: CE Mark; Library Reference: CE Mark
ZZ1 = CMP-0077236-1: CompType: AssemblyNote; ClassName: AssemblyNote; Publisher: Texas Instruments; LatestRevisionDate: 2017-08-10; Key: AssemblyNote
ZZ2 = CMP-0077237-1: CompType: AssemblyNote; ClassName: AssemblyNote; Publisher: Texas Instruments; LatestRevisionDate: 2017-08-10; Key: AssemblyNote
ZZ3 = CMP-0077238-1: CompType: AssemblyNote; ClassName: AssemblyNote; Publisher: Texas Instruments; LatestRevisionDate: 2017-08-10; Key: AssemblyNote